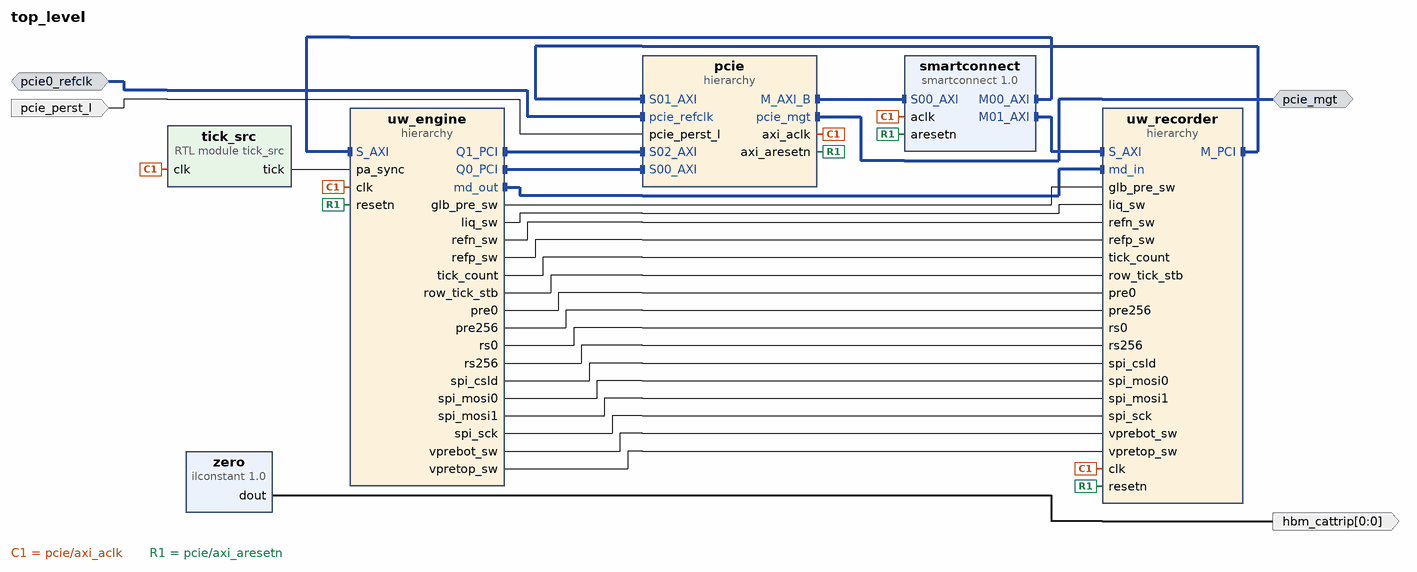
[diagram p0: block diagram of the top level]
# Vivado block design top_level, xcu55c-fsvh2892-2L-e, Vivado 2024.2
create_bd_design top_level

create_bd_intf_port -mode Slave -vlnv xilinx.com:interface:diff_clock_rtl:1.0 pcie0_refclk
create_bd_intf_port -mode Master -vlnv xilinx.com:interface:pcie_7x_mgt_rtl:1.0 pcie_mgt
create_bd_port -dir I pcie_perst_l
create_bd_port -dir O -from 0 -to 0 hbm_cattrip

create_bd_cell -type hier pcie
create_bd_cell -type ip -vlnv xilinx.com:ip:smartconnect:1.0 smartconnect
set_property -dict {CONFIG.NUM_CLKS 1 CONFIG.NUM_MI 2 CONFIG.NUM_SI 1} [get_bd_cells smartconnect]
create_bd_cell -type inline_hdl -vlnv xilinx.com:inline_hdl:ilconstant:1.0 zero
create_bd_cell -type hier uw_engine
create_bd_cell -type module -reference tick_src tick_src
set_property -dict {CONFIG.PERIOD 256} [get_bd_cells tick_src]
create_bd_cell -type hier uw_recorder

# ---- hierarchy /pcie ----
current_bd_instance /pcie
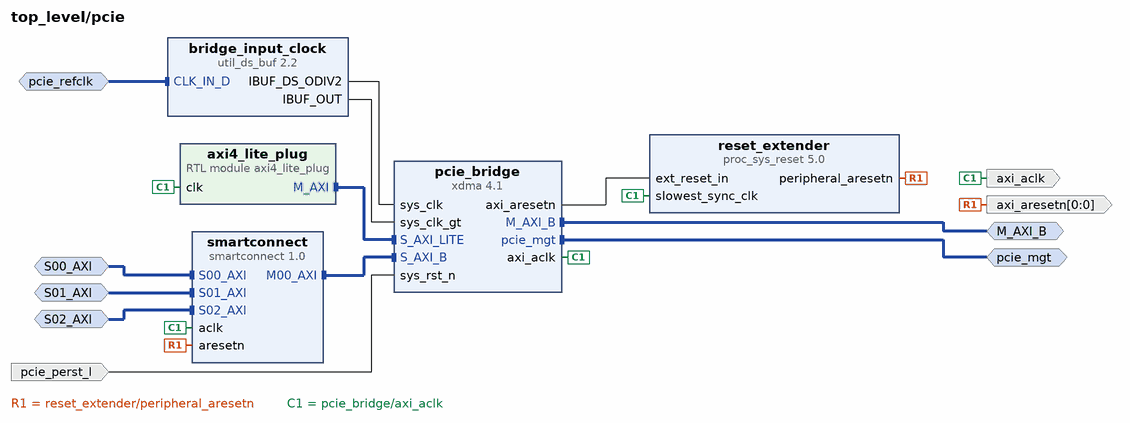
[diagram p1: block diagram inside /pcie]
create_bd_intf_pin -mode Master -vlnv xilinx.com:interface:aximm_rtl:1.0 M_AXI_B
create_bd_intf_pin -mode Master -vlnv xilinx.com:interface:pcie_7x_mgt_rtl:1.0 pcie_mgt
create_bd_intf_pin -mode Slave -vlnv xilinx.com:interface:diff_clock_rtl:1.0 pcie_refclk
create_bd_intf_pin -mode Slave -vlnv xilinx.com:interface:aximm_rtl:1.0 S00_AXI
create_bd_intf_pin -mode Slave -vlnv xilinx.com:interface:aximm_rtl:1.0 S01_AXI
create_bd_intf_pin -mode Slave -vlnv xilinx.com:interface:aximm_rtl:1.0 S02_AXI
create_bd_pin -dir O -type clk axi_aclk
create_bd_pin -dir O -from 0 -to 0 -type rst axi_aresetn
create_bd_pin -dir I pcie_perst_l

create_bd_cell -type ip -vlnv xilinx.com:ip:proc_sys_reset:5.0 reset_extender
create_bd_cell -type ip -vlnv xilinx.com:ip:util_ds_buf:2.2 bridge_input_clock
set_property -dict {CONFIG.C_BUF_TYPE IBUFDSGTE} [get_bd_cells bridge_input_clock]
create_bd_cell -type ip -vlnv xilinx.com:ip:xdma:4.1 pcie_bridge
set_property -dict [list \
  CONFIG.PF0_DEVICE_ID_mqdma 9048 \
  CONFIG.PF0_SRIOV_VF_DEVICE_ID A048 \
  CONFIG.PF2_DEVICE_ID_mqdma 9248 \
  CONFIG.PF3_DEVICE_ID_mqdma 9348 \
  CONFIG.axi_addr_width 64 \
  CONFIG.axi_data_width 512_bit \
  CONFIG.axisten_freq 250 \
  CONFIG.bridge_burst true \
  CONFIG.dma_reset_source_sel User_Reset \
  CONFIG.en_axi_slave_if true \
  CONFIG.enable_jtag_dbg false \
  CONFIG.functional_mode AXI_Bridge \
  CONFIG.mode_selection Advanced \
  CONFIG.pcie_blk_locn PCIE4C_X1Y1 \
  CONFIG.pf0_bar0_scale Megabytes \
  CONFIG.pf0_bar0_size 1 \
  CONFIG.pf0_device_id 903f \
  CONFIG.pl_link_cap_max_link_speed 16.0_GT/s \
  CONFIG.pl_link_cap_max_link_width X8 \
  CONFIG.runbit_fix false \
] [get_bd_cells pcie_bridge]
create_bd_cell -type module -reference axi4_lite_plug axi4_lite_plug
create_bd_cell -type ip -vlnv xilinx.com:ip:smartconnect:1.0 smartconnect
set_property -dict {CONFIG.NUM_SI 3} [get_bd_cells smartconnect]

# ---- hierarchy /uw_engine ----
current_bd_instance /uw_engine
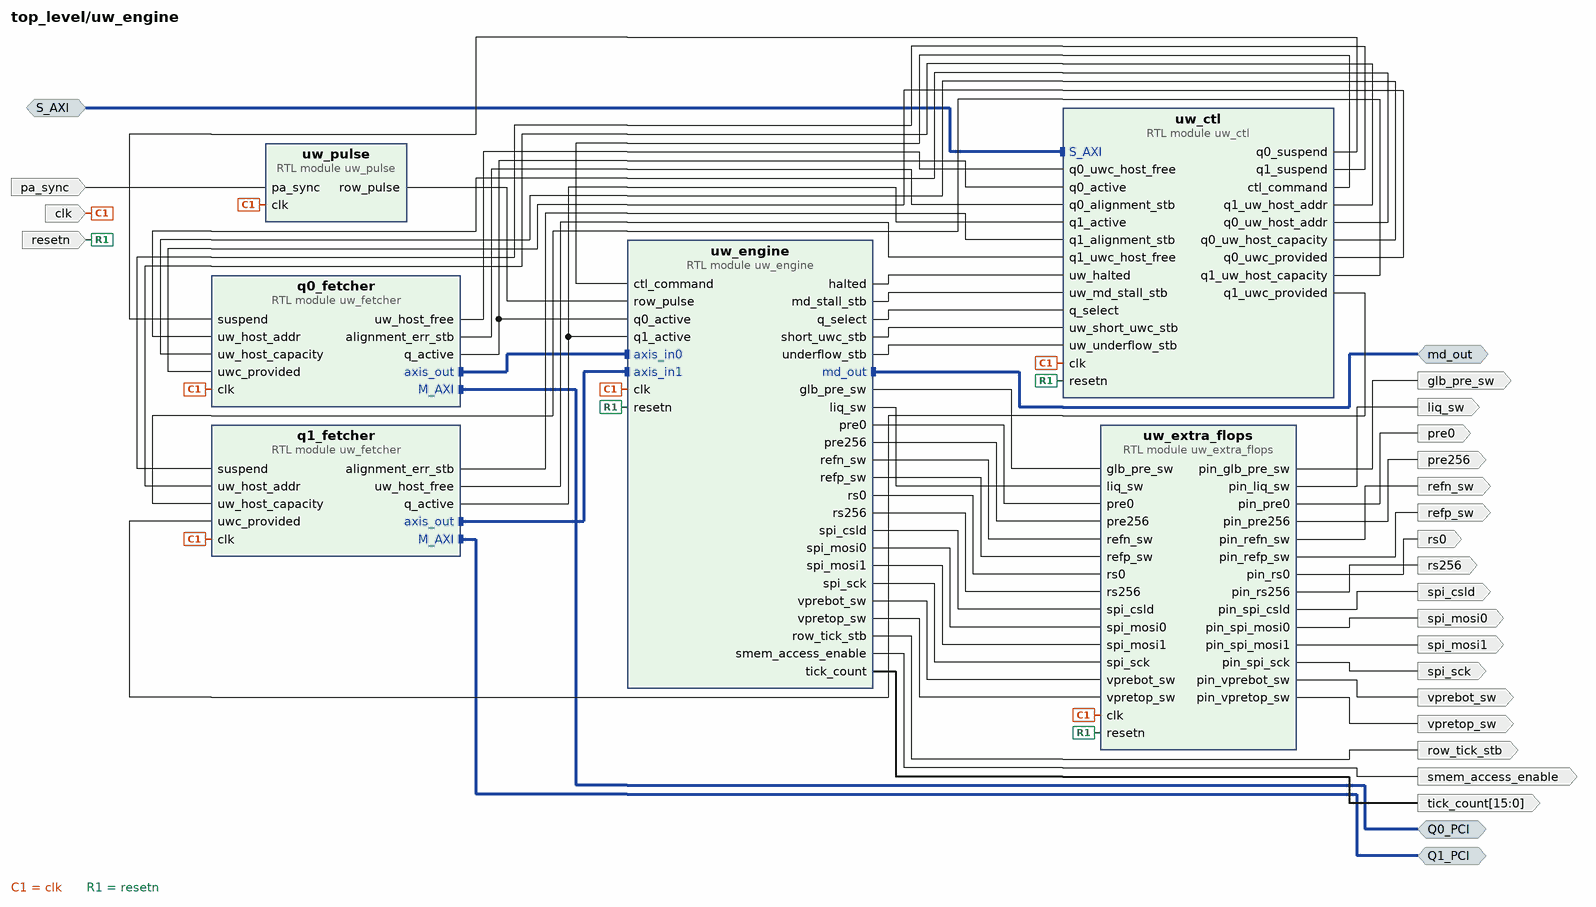
[diagram p2: block diagram inside /uw_engine]
create_bd_intf_pin -mode Master -vlnv xilinx.com:interface:aximm_rtl:1.0 Q0_PCI
create_bd_intf_pin -mode Slave -vlnv xilinx.com:interface:aximm_rtl:1.0 S_AXI
create_bd_intf_pin -mode Master -vlnv xilinx.com:interface:aximm_rtl:1.0 Q1_PCI
create_bd_intf_pin -mode Master -vlnv xilinx.com:interface:axis_rtl:1.0 md_out
create_bd_pin -dir I -type clk clk
create_bd_pin -dir I -type rst resetn
create_bd_pin -dir O spi_csld
create_bd_pin -dir O spi_sck
create_bd_pin -dir O spi_mosi0
create_bd_pin -dir O spi_mosi1
create_bd_pin -dir O liq_sw
create_bd_pin -dir O -from 15 -to 0 tick_count
create_bd_pin -dir O vpretop_sw
create_bd_pin -dir O vprebot_sw
create_bd_pin -dir O refp_sw
create_bd_pin -dir O refn_sw
create_bd_pin -dir O glb_pre_sw
create_bd_pin -dir O pre0
create_bd_pin -dir O pre256
create_bd_pin -dir O rs0
create_bd_pin -dir O rs256
create_bd_pin -dir I pa_sync
create_bd_pin -dir O row_tick_stb
create_bd_pin -dir O smem_access_enable

create_bd_cell -type module -reference uw_fetcher q0_fetcher
create_bd_cell -type module -reference uw_ctl uw_ctl
create_bd_cell -type module -reference uw_engine uw_engine
create_bd_cell -type module -reference uw_pulse uw_pulse
set_property -dict {CONFIG.PERIOD 256} [get_bd_cells uw_pulse]
create_bd_cell -type module -reference uw_extra_flops uw_extra_flops
create_bd_cell -type module -reference uw_fetcher q1_fetcher

# ---- hierarchy /uw_recorder ----
current_bd_instance /uw_recorder
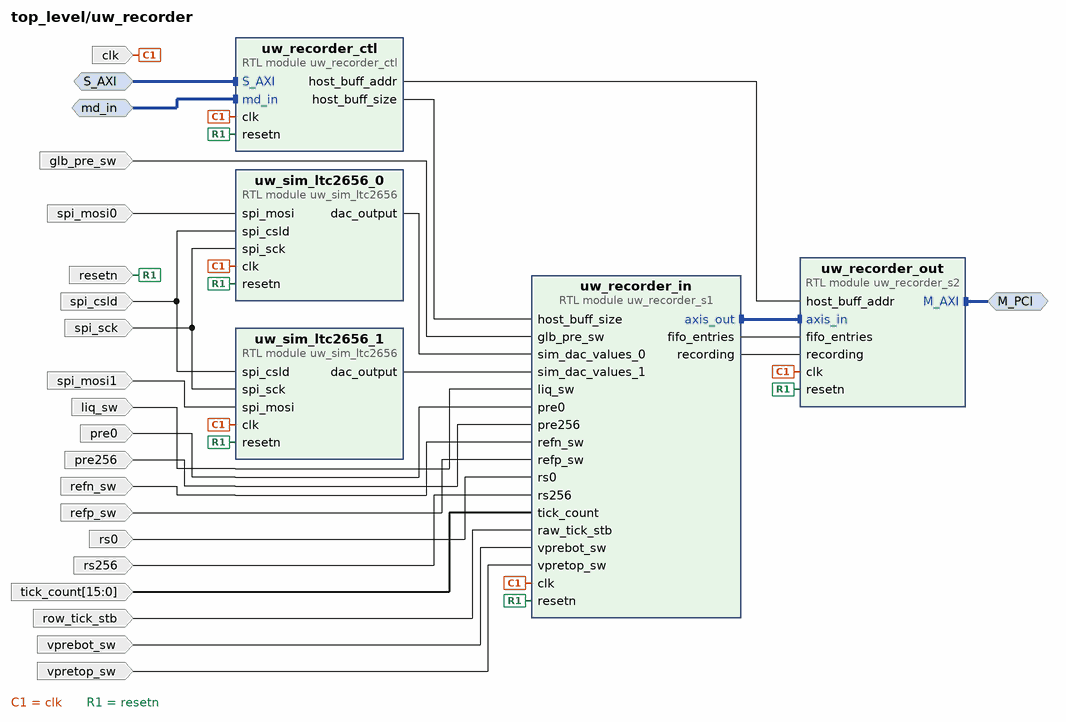
[diagram p3: block diagram inside /uw_recorder]
create_bd_intf_pin -mode Master -vlnv xilinx.com:interface:aximm_rtl:1.0 M_PCI
create_bd_intf_pin -mode Slave -vlnv xilinx.com:interface:aximm_rtl:1.0 S_AXI
create_bd_intf_pin -mode Slave -vlnv xilinx.com:interface:axis_rtl:1.0 md_in
create_bd_pin -dir I clk
create_bd_pin -dir I resetn
create_bd_pin -dir I row_tick_stb
create_bd_pin -dir I -from 15 -to 0 tick_count
create_bd_pin -dir I liq_sw
create_bd_pin -dir I vpretop_sw
create_bd_pin -dir I vprebot_sw
create_bd_pin -dir I refp_sw
create_bd_pin -dir I refn_sw
create_bd_pin -dir I glb_pre_sw
create_bd_pin -dir I rs0
create_bd_pin -dir I rs256
create_bd_pin -dir I pre0
create_bd_pin -dir I pre256
create_bd_pin -dir I spi_csld
create_bd_pin -dir I spi_sck
create_bd_pin -dir I spi_mosi0
create_bd_pin -dir I spi_mosi1

create_bd_cell -type module -reference uw_recorder_s2 uw_recorder_out
create_bd_cell -type module -reference uw_recorder_s1 uw_recorder_in
create_bd_cell -type module -reference uw_sim_ltc2656 uw_sim_ltc2656_0
create_bd_cell -type module -reference uw_sim_ltc2656 uw_sim_ltc2656_1
create_bd_cell -type module -reference uw_recorder_ctl uw_recorder_ctl

# ---- connections ----

current_bd_instance /pcie
connect_bd_intf_net [get_bd_intf_pins pcie_refclk] [get_bd_intf_pins bridge_input_clock/CLK_IN_D]
connect_bd_intf_net [get_bd_intf_pins S00_AXI] [get_bd_intf_pins smartconnect/S00_AXI]
connect_bd_intf_net [get_bd_intf_pins S01_AXI] [get_bd_intf_pins smartconnect/S01_AXI]
connect_bd_intf_net [get_bd_intf_pins S02_AXI] [get_bd_intf_pins smartconnect/S02_AXI]
connect_bd_intf_net -intf_net axi4_lite_plug_0_M_AXI [get_bd_intf_pins axi4_lite_plug/M_AXI] [get_bd_intf_pins pcie_bridge/S_AXI_LITE]
connect_bd_intf_net -intf_net smartconnect_0_M00_AXI [get_bd_intf_pins smartconnect/M00_AXI] [get_bd_intf_pins pcie_bridge/S_AXI_B]
connect_bd_intf_net -intf_net xdma_0_M_AXI_B [get_bd_intf_pins M_AXI_B] [get_bd_intf_pins pcie_bridge/M_AXI_B]
connect_bd_intf_net -intf_net xdma_0_pcie_mgt [get_bd_intf_pins pcie_mgt] [get_bd_intf_pins pcie_bridge/pcie_mgt]
connect_bd_net [get_bd_pins bridge_input_clock/IBUF_DS_ODIV2] [get_bd_pins pcie_bridge/sys_clk]
connect_bd_net [get_bd_pins bridge_input_clock/IBUF_OUT] [get_bd_pins pcie_bridge/sys_clk_gt]
connect_bd_net [get_bd_pins pcie_bridge/axi_aresetn] [get_bd_pins reset_extender/ext_reset_in]
connect_bd_net [get_bd_pins pcie_perst_l] [get_bd_pins pcie_bridge/sys_rst_n]
connect_bd_net -net proc_sys_reset_0_peripheral_aresetn [get_bd_pins reset_extender/peripheral_aresetn] \
  [get_bd_pins axi_aresetn] [get_bd_pins smartconnect/aresetn]
connect_bd_net -net xdma_0_axi_aclk [get_bd_pins pcie_bridge/axi_aclk] \
  [get_bd_pins axi_aclk] [get_bd_pins reset_extender/slowest_sync_clk] [get_bd_pins axi4_lite_plug/clk] \
  [get_bd_pins smartconnect/aclk]

current_bd_instance /uw_engine
connect_bd_intf_net [get_bd_intf_pins S_AXI] [get_bd_intf_pins uw_ctl/S_AXI]
connect_bd_intf_net [get_bd_intf_pins md_out] [get_bd_intf_pins uw_engine/md_out]
connect_bd_intf_net -intf_net uw_fetcher_0_M_AXI [get_bd_intf_pins Q0_PCI] [get_bd_intf_pins q0_fetcher/M_AXI]
connect_bd_intf_net -intf_net uw_fetcher_1_M_AXI [get_bd_intf_pins Q1_PCI] [get_bd_intf_pins q1_fetcher/M_AXI]
connect_bd_intf_net -intf_net uw_fetcher_1_axis_out [get_bd_intf_pins q1_fetcher/axis_out] [get_bd_intf_pins uw_engine/axis_in1]
connect_bd_intf_net -intf_net uw_fetcher_axis_out [get_bd_intf_pins uw_engine/axis_in0] [get_bd_intf_pins q0_fetcher/axis_out]
connect_bd_net [get_bd_pins clk] \
  [get_bd_pins uw_extra_flops/clk] [get_bd_pins uw_ctl/clk] [get_bd_pins q0_fetcher/clk] [get_bd_pins q1_fetcher/clk] \
  [get_bd_pins uw_engine/clk] [get_bd_pins uw_pulse/clk]
connect_bd_net [get_bd_pins pa_sync] [get_bd_pins uw_pulse/pa_sync]
connect_bd_net [get_bd_pins resetn] [get_bd_pins uw_extra_flops/resetn] [get_bd_pins uw_ctl/resetn] [get_bd_pins uw_engine/resetn]
connect_bd_net [get_bd_pins uw_ctl/ctl_command] [get_bd_pins uw_engine/ctl_command]
connect_bd_net [get_bd_pins uw_ctl/q0_suspend] [get_bd_pins q0_fetcher/suspend]
connect_bd_net [get_bd_pins uw_ctl/q1_suspend] [get_bd_pins q1_fetcher/suspend]
connect_bd_net [get_bd_pins uw_ctl/q1_uw_host_addr] [get_bd_pins q1_fetcher/uw_host_addr]
connect_bd_net [get_bd_pins uw_ctl/q1_uw_host_capacity] [get_bd_pins q1_fetcher/uw_host_capacity]
connect_bd_net [get_bd_pins uw_ctl/q1_uwc_provided] [get_bd_pins q1_fetcher/uwc_provided]
connect_bd_net -net uw_ctl_uw_host_addr [get_bd_pins uw_ctl/q0_uw_host_addr] [get_bd_pins q0_fetcher/uw_host_addr]
connect_bd_net -net uw_ctl_uw_host_capacity [get_bd_pins uw_ctl/q0_uw_host_capacity] [get_bd_pins q0_fetcher/uw_host_capacity]
connect_bd_net -net uw_ctl_uwc_provided [get_bd_pins uw_ctl/q0_uwc_provided] [get_bd_pins q0_fetcher/uwc_provided]
connect_bd_net [get_bd_pins uw_engine/glb_pre_sw] [get_bd_pins uw_extra_flops/glb_pre_sw]
connect_bd_net [get_bd_pins uw_engine/halted] [get_bd_pins uw_ctl/uw_halted]
connect_bd_net [get_bd_pins uw_engine/liq_sw] [get_bd_pins uw_extra_flops/liq_sw]
connect_bd_net [get_bd_pins uw_engine/md_stall_stb] [get_bd_pins uw_ctl/uw_md_stall_stb]
connect_bd_net [get_bd_pins uw_engine/pre0] [get_bd_pins uw_extra_flops/pre0]
connect_bd_net [get_bd_pins uw_engine/pre256] [get_bd_pins uw_extra_flops/pre256]
connect_bd_net [get_bd_pins uw_engine/q_select] [get_bd_pins uw_ctl/q_select]
connect_bd_net [get_bd_pins uw_engine/refn_sw] [get_bd_pins uw_extra_flops/refn_sw]
connect_bd_net [get_bd_pins uw_engine/refp_sw] [get_bd_pins uw_extra_flops/refp_sw]
connect_bd_net [get_bd_pins uw_engine/row_tick_stb] [get_bd_pins row_tick_stb]
connect_bd_net [get_bd_pins uw_engine/rs0] [get_bd_pins uw_extra_flops/rs0]
connect_bd_net [get_bd_pins uw_engine/rs256] [get_bd_pins uw_extra_flops/rs256]
connect_bd_net [get_bd_pins uw_engine/short_uwc_stb] [get_bd_pins uw_ctl/uw_short_uwc_stb]
connect_bd_net [get_bd_pins uw_engine/smem_access_enable] [get_bd_pins smem_access_enable]
connect_bd_net [get_bd_pins uw_engine/spi_csld] [get_bd_pins uw_extra_flops/spi_csld]
connect_bd_net [get_bd_pins uw_engine/spi_mosi0] [get_bd_pins uw_extra_flops/spi_mosi0]
connect_bd_net [get_bd_pins uw_engine/spi_mosi1] [get_bd_pins uw_extra_flops/spi_mosi1]
connect_bd_net [get_bd_pins uw_engine/spi_sck] [get_bd_pins uw_extra_flops/spi_sck]
connect_bd_net [get_bd_pins uw_engine/tick_count] [get_bd_pins tick_count]
connect_bd_net [get_bd_pins uw_engine/underflow_stb] [get_bd_pins uw_ctl/uw_underflow_stb]
connect_bd_net [get_bd_pins uw_engine/vprebot_sw] [get_bd_pins uw_extra_flops/vprebot_sw]
connect_bd_net [get_bd_pins uw_engine/vpretop_sw] [get_bd_pins uw_extra_flops/vpretop_sw]
connect_bd_net -net uw_extra_flops_0_pin_glb_pre_sw [get_bd_pins uw_extra_flops/pin_glb_pre_sw] [get_bd_pins glb_pre_sw]
connect_bd_net -net uw_extra_flops_0_pin_liq_sw [get_bd_pins uw_extra_flops/pin_liq_sw] [get_bd_pins liq_sw]
connect_bd_net -net uw_extra_flops_0_pin_pre0 [get_bd_pins uw_extra_flops/pin_pre0] [get_bd_pins pre0]
connect_bd_net -net uw_extra_flops_0_pin_pre256 [get_bd_pins uw_extra_flops/pin_pre256] [get_bd_pins pre256]
connect_bd_net -net uw_extra_flops_0_pin_refn_sw [get_bd_pins uw_extra_flops/pin_refn_sw] [get_bd_pins refn_sw]
connect_bd_net -net uw_extra_flops_0_pin_refp_sw [get_bd_pins uw_extra_flops/pin_refp_sw] [get_bd_pins refp_sw]
connect_bd_net -net uw_extra_flops_0_pin_rs0 [get_bd_pins uw_extra_flops/pin_rs0] [get_bd_pins rs0]
connect_bd_net -net uw_extra_flops_0_pin_rs256 [get_bd_pins uw_extra_flops/pin_rs256] [get_bd_pins rs256]
connect_bd_net -net uw_extra_flops_0_pin_spi_csld [get_bd_pins uw_extra_flops/pin_spi_csld] [get_bd_pins spi_csld]
connect_bd_net -net uw_extra_flops_0_pin_spi_mosi0 [get_bd_pins uw_extra_flops/pin_spi_mosi0] [get_bd_pins spi_mosi0]
connect_bd_net -net uw_extra_flops_0_pin_spi_mosi1 [get_bd_pins uw_extra_flops/pin_spi_mosi1] [get_bd_pins spi_mosi1]
connect_bd_net -net uw_extra_flops_0_pin_spi_sck [get_bd_pins uw_extra_flops/pin_spi_sck] [get_bd_pins spi_sck]
connect_bd_net -net uw_extra_flops_0_pin_vprebot_sw [get_bd_pins uw_extra_flops/pin_vprebot_sw] [get_bd_pins vprebot_sw]
connect_bd_net -net uw_extra_flops_0_pin_vpretop_sw [get_bd_pins uw_extra_flops/pin_vpretop_sw] [get_bd_pins vpretop_sw]
connect_bd_net -net uw_fetcher_0_q_active [get_bd_pins q0_fetcher/q_active] [get_bd_pins uw_ctl/q0_active] [get_bd_pins uw_engine/q0_active]
connect_bd_net -net uw_fetcher_0_uw_host_free [get_bd_pins q0_fetcher/uw_host_free] [get_bd_pins uw_ctl/q0_uwc_host_free]
connect_bd_net -net uw_fetcher_1_alignment_err_stb [get_bd_pins q1_fetcher/alignment_err_stb] [get_bd_pins uw_ctl/q1_alignment_stb]
connect_bd_net -net uw_fetcher_1_q_active [get_bd_pins q1_fetcher/q_active] [get_bd_pins uw_ctl/q1_active] [get_bd_pins uw_engine/q1_active]
connect_bd_net -net uw_fetcher_1_uw_host_free [get_bd_pins q1_fetcher/uw_host_free] [get_bd_pins uw_ctl/q1_uwc_host_free]
connect_bd_net -net uw_fetcher_alignment_err_stb [get_bd_pins q0_fetcher/alignment_err_stb] [get_bd_pins uw_ctl/q0_alignment_stb]
connect_bd_net -net uw_pulse_pa_pulse [get_bd_pins uw_pulse/row_pulse] [get_bd_pins uw_engine/row_pulse]

current_bd_instance /uw_recorder
connect_bd_intf_net [get_bd_intf_pins S_AXI] [get_bd_intf_pins uw_recorder_ctl/S_AXI]
connect_bd_intf_net [get_bd_intf_pins md_in] [get_bd_intf_pins uw_recorder_ctl/md_in]
connect_bd_intf_net -intf_net uw_recorder_s1_0_axis_out [get_bd_intf_pins uw_recorder_in/axis_out] [get_bd_intf_pins uw_recorder_out/axis_in]
connect_bd_intf_net -intf_net uw_recorder_s2_0_M_AXI [get_bd_intf_pins M_PCI] [get_bd_intf_pins uw_recorder_out/M_AXI]
connect_bd_net [get_bd_pins clk] \
  [get_bd_pins uw_sim_ltc2656_0/clk] [get_bd_pins uw_sim_ltc2656_1/clk] [get_bd_pins uw_recorder_out/clk] \
  [get_bd_pins uw_recorder_in/clk] [get_bd_pins uw_recorder_ctl/clk]
connect_bd_net [get_bd_pins glb_pre_sw] [get_bd_pins uw_recorder_in/glb_pre_sw]
connect_bd_net [get_bd_pins liq_sw] [get_bd_pins uw_recorder_in/liq_sw]
connect_bd_net -net pre0_1 [get_bd_pins pre0] [get_bd_pins uw_recorder_in/pre0]
connect_bd_net -net pre256_1 [get_bd_pins pre256] [get_bd_pins uw_recorder_in/pre256]
connect_bd_net [get_bd_pins refn_sw] [get_bd_pins uw_recorder_in/refn_sw]
connect_bd_net [get_bd_pins refp_sw] [get_bd_pins uw_recorder_in/refp_sw]
connect_bd_net [get_bd_pins resetn] \
  [get_bd_pins uw_sim_ltc2656_0/resetn] [get_bd_pins uw_sim_ltc2656_1/resetn] [get_bd_pins uw_recorder_out/resetn] \
  [get_bd_pins uw_recorder_in/resetn] [get_bd_pins uw_recorder_ctl/resetn]
connect_bd_net -net rs0_1 [get_bd_pins rs0] [get_bd_pins uw_recorder_in/rs0]
connect_bd_net -net rs256_1 [get_bd_pins rs256] [get_bd_pins uw_recorder_in/rs256]
connect_bd_net [get_bd_pins spi_csld] [get_bd_pins uw_sim_ltc2656_0/spi_csld] [get_bd_pins uw_sim_ltc2656_1/spi_csld]
connect_bd_net -net spi_mosi0_1 [get_bd_pins spi_mosi0] [get_bd_pins uw_sim_ltc2656_0/spi_mosi]
connect_bd_net -net spi_mosi1_1 [get_bd_pins spi_mosi1] [get_bd_pins uw_sim_ltc2656_1/spi_mosi]
connect_bd_net [get_bd_pins spi_sck] [get_bd_pins uw_sim_ltc2656_0/spi_sck] [get_bd_pins uw_sim_ltc2656_1/spi_sck]
connect_bd_net [get_bd_pins tick_count] [get_bd_pins uw_recorder_in/tick_count]
connect_bd_net -net tick_stb_1 [get_bd_pins row_tick_stb] [get_bd_pins uw_recorder_in/raw_tick_stb]
connect_bd_net [get_bd_pins uw_recorder_ctl/host_buff_addr] [get_bd_pins uw_recorder_out/host_buff_addr]
connect_bd_net [get_bd_pins uw_recorder_ctl/host_buff_size] [get_bd_pins uw_recorder_in/host_buff_size]
connect_bd_net -net uw_recorder_s1_0_fifo_entries [get_bd_pins uw_recorder_in/fifo_entries] [get_bd_pins uw_recorder_out/fifo_entries]
connect_bd_net -net uw_recorder_s1_0_recording [get_bd_pins uw_recorder_in/recording] [get_bd_pins uw_recorder_out/recording]
connect_bd_net [get_bd_pins uw_sim_ltc2656_0/dac_output] [get_bd_pins uw_recorder_in/sim_dac_values_0]
connect_bd_net [get_bd_pins uw_sim_ltc2656_1/dac_output] [get_bd_pins uw_recorder_in/sim_dac_values_1]
connect_bd_net [get_bd_pins vprebot_sw] [get_bd_pins uw_recorder_in/vprebot_sw]
connect_bd_net [get_bd_pins vpretop_sw] [get_bd_pins uw_recorder_in/vpretop_sw]

current_bd_instance /
connect_bd_intf_net -intf_net hier_0_M_AXI [get_bd_intf_pins uw_recorder/M_PCI] [get_bd_intf_pins pcie/S01_AXI]
connect_bd_intf_net [get_bd_intf_ports pcie0_refclk] [get_bd_intf_pins pcie/pcie_refclk]
connect_bd_intf_net [get_bd_intf_pins uw_engine/S_AXI] [get_bd_intf_pins smartconnect/M00_AXI]
connect_bd_intf_net [get_bd_intf_pins smartconnect/M01_AXI] [get_bd_intf_pins uw_recorder/S_AXI]
connect_bd_intf_net -intf_net uw_engine_PCI_1 [get_bd_intf_pins uw_engine/Q1_PCI] [get_bd_intf_pins pcie/S02_AXI]
connect_bd_intf_net [get_bd_intf_pins uw_engine/md_out] [get_bd_intf_pins uw_recorder/md_in]
connect_bd_intf_net -intf_net uwfetcher_0_M_AXI [get_bd_intf_pins uw_engine/Q0_PCI] [get_bd_intf_pins pcie/S00_AXI]
connect_bd_intf_net -intf_net xdma_0_M_AXI_B [get_bd_intf_pins pcie/M_AXI_B] [get_bd_intf_pins smartconnect/S00_AXI]
connect_bd_intf_net -intf_net xdma_0_pcie_mgt [get_bd_intf_ports pcie_mgt] [get_bd_intf_pins pcie/pcie_mgt]
connect_bd_net -net glb_pre_sw_1 [get_bd_pins uw_engine/glb_pre_sw] [get_bd_pins uw_recorder/glb_pre_sw]
connect_bd_net -net liq_sw_1 [get_bd_pins uw_engine/liq_sw] [get_bd_pins uw_recorder/liq_sw]
connect_bd_net [get_bd_ports pcie_perst_l] [get_bd_pins pcie/pcie_perst_l]
connect_bd_net -net refn_sw_1 [get_bd_pins uw_engine/refn_sw] [get_bd_pins uw_recorder/refn_sw]
connect_bd_net -net refp_sw_1 [get_bd_pins uw_engine/refp_sw] [get_bd_pins uw_recorder/refp_sw]
connect_bd_net -net source_200Mhz_clk [get_bd_pins pcie/axi_aclk] \
  [get_bd_pins smartconnect/aclk] [get_bd_pins uw_engine/clk] [get_bd_pins tick_src/clk] [get_bd_pins uw_recorder/clk]
connect_bd_net -net source_200Mhz_resetn [get_bd_pins pcie/axi_aresetn] \
  [get_bd_pins smartconnect/aresetn] [get_bd_pins uw_engine/resetn] [get_bd_pins uw_recorder/resetn]
connect_bd_net -net tick_count_1 [get_bd_pins uw_engine/tick_count] [get_bd_pins uw_recorder/tick_count]
connect_bd_net [get_bd_pins tick_src/tick] [get_bd_pins uw_engine/pa_sync]
connect_bd_net -net tick_stb_1 [get_bd_pins uw_engine/row_tick_stb] [get_bd_pins uw_recorder/row_tick_stb]
connect_bd_net [get_bd_pins uw_engine/pre0] [get_bd_pins uw_recorder/pre0]
connect_bd_net [get_bd_pins uw_engine/pre256] [get_bd_pins uw_recorder/pre256]
connect_bd_net [get_bd_pins uw_engine/rs0] [get_bd_pins uw_recorder/rs0]
connect_bd_net [get_bd_pins uw_engine/rs256] [get_bd_pins uw_recorder/rs256]
connect_bd_net [get_bd_pins uw_engine/spi_csld] [get_bd_pins uw_recorder/spi_csld]
connect_bd_net [get_bd_pins uw_engine/spi_mosi0] [get_bd_pins uw_recorder/spi_mosi0]
connect_bd_net [get_bd_pins uw_engine/spi_mosi1] [get_bd_pins uw_recorder/spi_mosi1]
connect_bd_net [get_bd_pins uw_engine/spi_sck] [get_bd_pins uw_recorder/spi_sck]
connect_bd_net -net vprebot_sw_1 [get_bd_pins uw_engine/vprebot_sw] [get_bd_pins uw_recorder/vprebot_sw]
connect_bd_net -net vpretop_sw_1 [get_bd_pins uw_engine/vpretop_sw] [get_bd_pins uw_recorder/vpretop_sw]
connect_bd_net [get_bd_pins zero/dout] [get_bd_ports hbm_cattrip]

# ---- address map ----
assign_bd_address -offset 0x00000000 -range 512M -target_address_space [get_bd_addr_spaces pcie/axi4_lite_plug/M_AXI] [get_bd_addr_segs pcie/pcie_bridge/S_AXI_LITE/CTL0]
assign_bd_address -offset 0x0000000000001000 -range 4K -target_address_space [get_bd_addr_spaces pcie/pcie_bridge/M_AXI_B] [get_bd_addr_segs uw_engine/uw_ctl/S_AXI/reg0]
assign_bd_address -offset 0x0000000000002000 -range 4K -target_address_space [get_bd_addr_spaces pcie/pcie_bridge/M_AXI_B] [get_bd_addr_segs uw_recorder/uw_recorder_ctl/S_AXI/reg0]
assign_bd_address -offset 0x0000000000000000 -range 16E -target_address_space [get_bd_addr_spaces uw_engine/q0_fetcher/M_AXI] [get_bd_addr_segs pcie/pcie_bridge/S_AXI_B/BAR0]
assign_bd_address -offset 0x0000000000000000 -range 16E -target_address_space [get_bd_addr_spaces uw_engine/q1_fetcher/M_AXI] [get_bd_addr_segs pcie/pcie_bridge/S_AXI_B/BAR0]
assign_bd_address -offset 0x0000000000000000 -range 16E -target_address_space [get_bd_addr_spaces uw_recorder/uw_recorder_out/M_AXI] [get_bd_addr_segs pcie/pcie_bridge/S_AXI_B/BAR0]

validate_bd_design
save_bd_design
